# Altium schematic sheet 02 - Power CSI and Bank Power.SchDoc: Power CSI and Banks
size A3; Page Number: 2; Page Size: B; Page Count: 12; Board Rev: B; Project Name: CrossLink-NX Evaluation Board; RevCode: 1.0; Doc: 305-PD-19-0819; DsnPath: C:\Users\HAltinkilit\Downloads\Crosslink-NX-Design-Files\CrossLink-NX-Eval-Brd-Schematic-RevB-191122.DSN; SchematicName: SCHEMATIC1; PageName: 11 - Power CSI and Bank Power; PageSize: B; TopSchematic: True
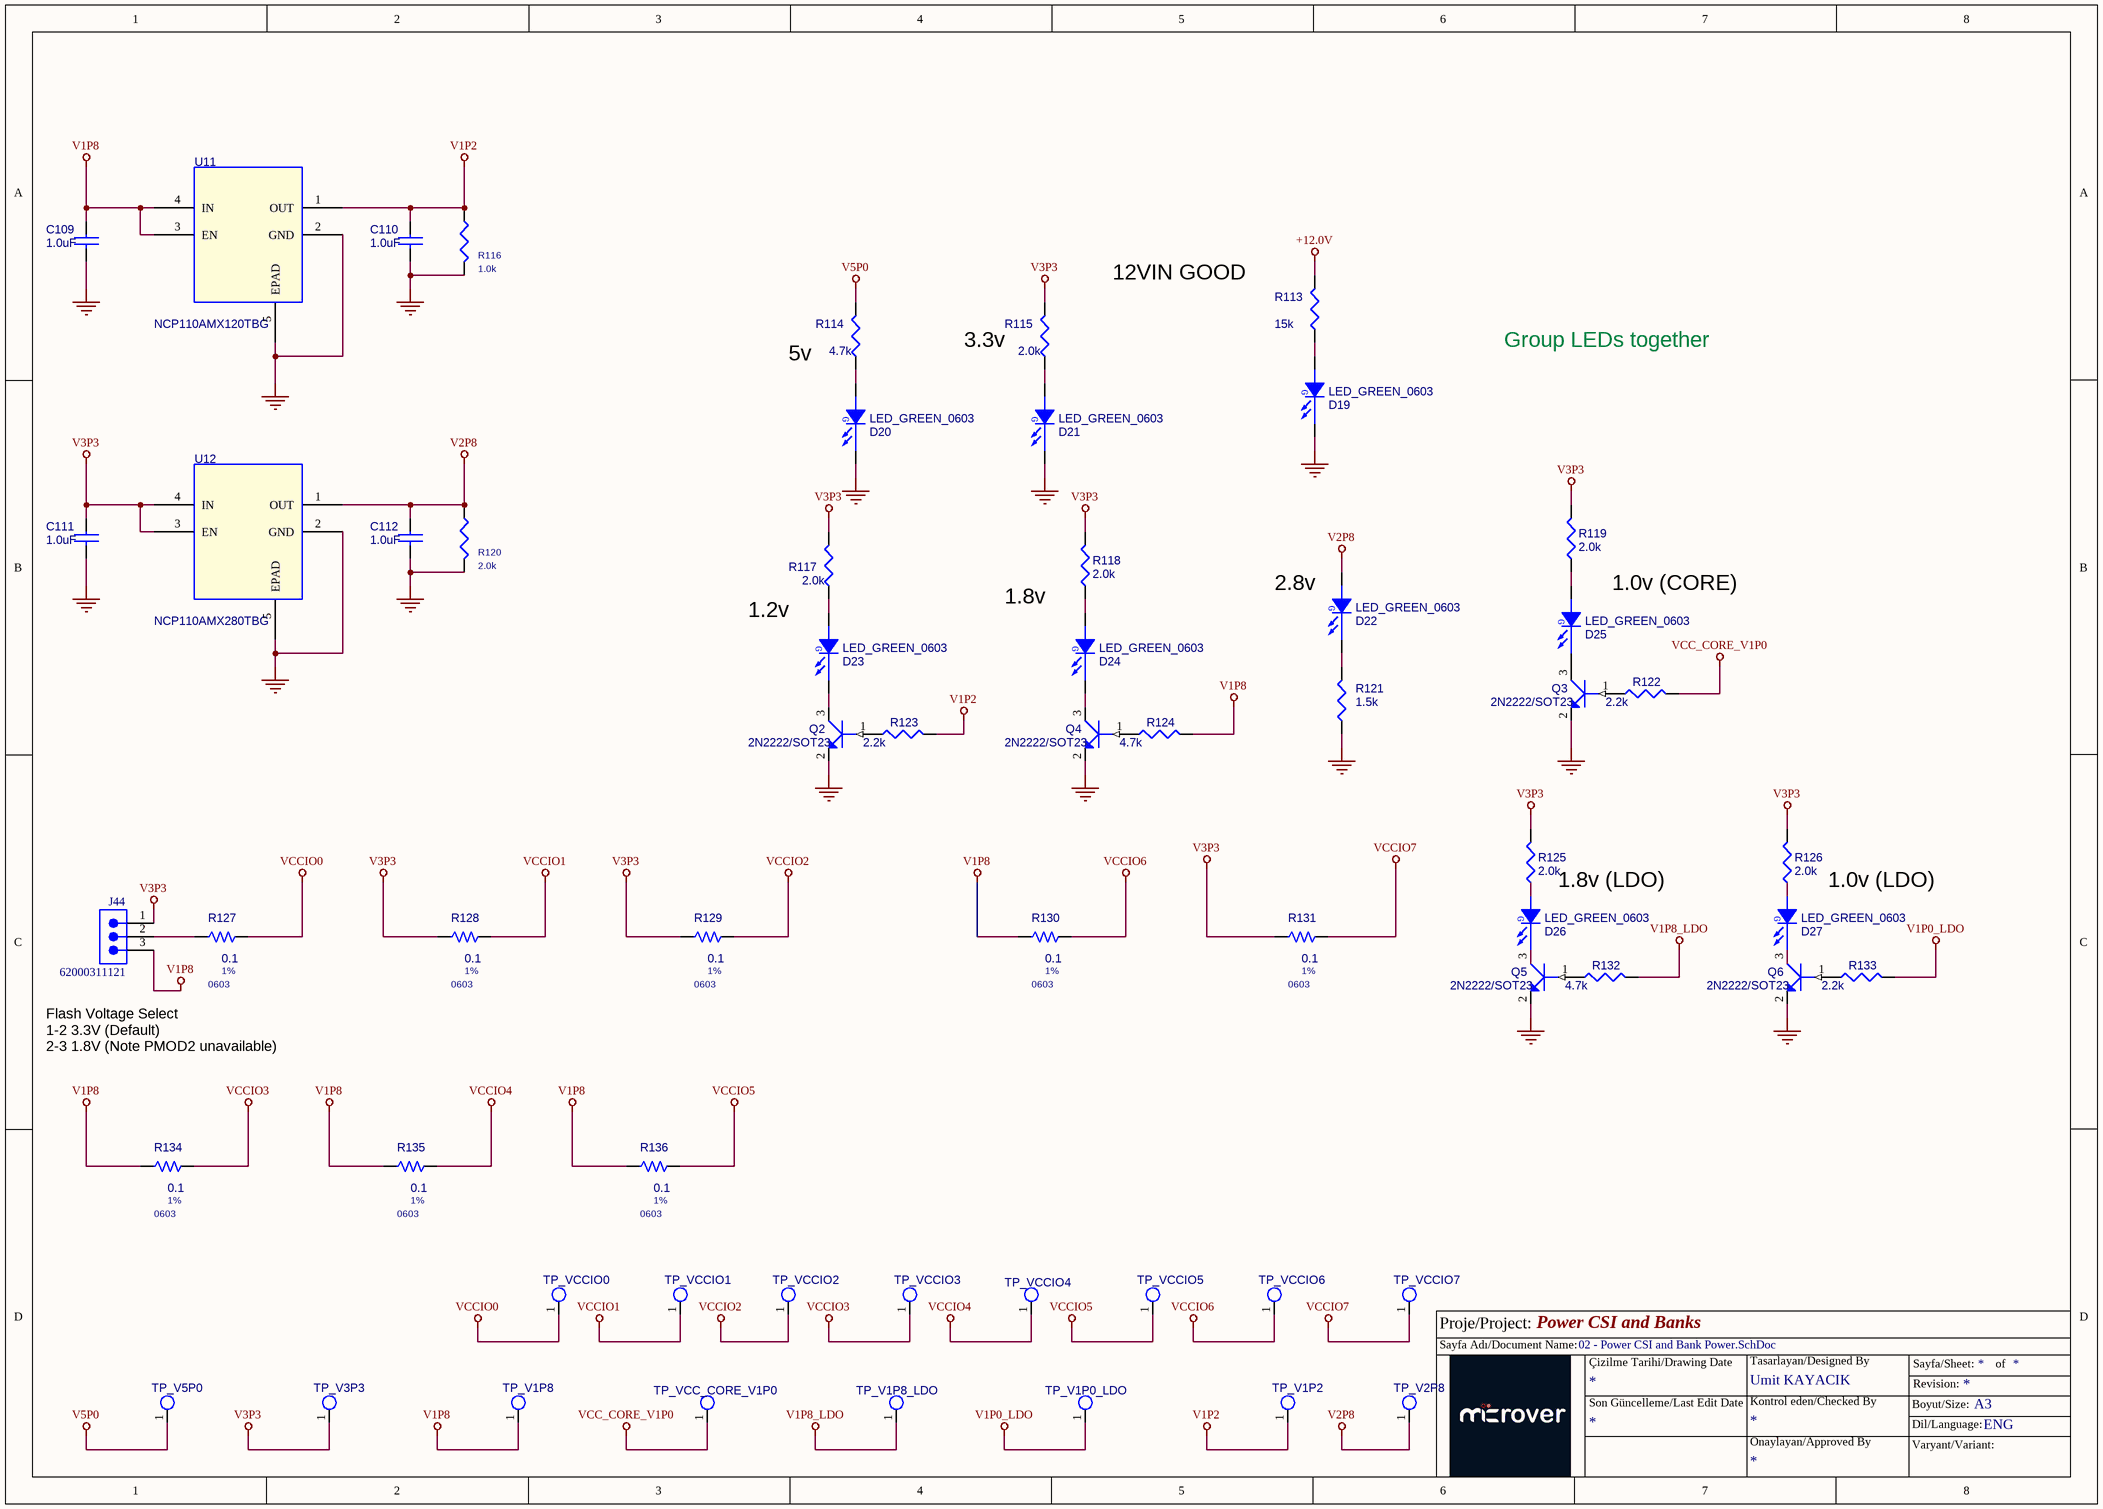
[diagram p0: 02 - Power CSI and Bank Power.SchDoc]

## Parts
C109  1.0uF  [C0603]
C110  1.0uF  [C0603]
C111  1.0uF  [C0603]
C112  1.0uF  [C0603]
D19  LED_GREEN_0603  [APT1608]
D20  LED_GREEN_0603  [APT1608]
D21  LED_GREEN_0603  [APT1608]
D22  LED_GREEN_0603  [APT1608]
D23  LED_GREEN_0603  [APT1608]
D24  LED_GREEN_0603  [APT1608]
D25  LED_GREEN_0603  [APT1608]
D26  LED_GREEN_0603  [APT1608]
D27  LED_GREEN_0603  [APT1608]
J44  62000311121  [62000311121]
Q2  2N2222/SOT23  [MMBT2222ALT-1]
Q3  2N2222/SOT23  [MMBT2222ALT-1]
Q4  2N2222/SOT23  [MMBT2222ALT-1]
Q5  2N2222/SOT23  [MMBT2222ALT-1]
Q6  2N2222/SOT23  [MMBT2222ALT-1]
R113  15k  [RLP-103]
R114  4.7k  [R0402]
R115  2.0k  [R0402]
R116  1.0k  [R0402]
R117  2.0k  [R0402]
R118  2.0k  [R0402]
R119  2.0k  [R0402]
R120  2.0k  [R0402]
R121  1.5k  [R0402]
R122  2.2k  [R0402]
R123  2.2k  [R0402]
R124  4.7k  [R0402]
R125  2.0k  [R0402]
R126  2.0k  [R0402]
R127  0.1  Tollerance: 1%  [0603]
R128  0.1  Tollerance: 1%  [0603]
R129  0.1  Tollerance: 1%  [0603]
R130  0.1  Tollerance: 1%  [0603]
R131  0.1  Tollerance: 1%  [0603]
R132  4.7k  [R0402]
R133  2.2k  [R0402]
R134  0.1  Tollerance: 1%  [0603]
R135  0.1  Tollerance: 1%  [0603]
R136  0.1  Tollerance: 1%  [0603]
TP_V1P0_LDO  TP_S_40_63  [TP_1MM]  (value not drawn)
TP_V1P2  TP_S_40_63  [TP_1MM]  (value not drawn)
TP_V1P8  TP_S_40_63  [TP_1MM]  (value not drawn)
TP_V1P8_LDO  TP_S_40_63  [TP_1MM]  (value not drawn)
TP_V2P8  TP_S_40_63  [TP_1MM]  (value not drawn)
TP_V3P3  TP_S_40_63  [TP_1MM]  (value not drawn)
TP_V5P0  TP_S_40_63  [TP_1MM]  (value not drawn)
TP_VCC_CORE_V1P0  TP_S_40_63  [TP_1MM]  (value not drawn)
TP_VCCIO0  TP_S_40_63  [TP_1MM]  (value not drawn)
TP_VCCIO1  TP_S_40_63  [TP_1MM]  (value not drawn)
TP_VCCIO2  TP_S_40_63  [TP_1MM]  (value not drawn)
TP_VCCIO3  TP_S_40_63  [TP_1MM]  (value not drawn)
TP_VCCIO4  TP_S_40_63  [TP_1MM]  (value not drawn)
TP_VCCIO5  TP_S_40_63  [TP_1MM]  (value not drawn)
TP_VCCIO6  TP_S_40_63  [TP_1MM]  (value not drawn)
TP_VCCIO7  TP_S_40_63  [TP_1MM]  (value not drawn)
U11  NCP110AMX120TBG  [4XDFN_NCP110]
U12  NCP110AMX280TBG  [4XDFN_NCP110]

## Nets
+12.0V: R113.2
GND: C109.2 C110.2 C111.2 C112.2 D19.1(CATHODE) D20.1(CATHODE) D21.1(CATHODE) Q2.2(EMITTER) Q3.2(EMITTER) Q4.2(EMITTER) Q5.2(EMITTER) Q6.2(EMITTER) R116.2 R120.2 R121.1 U11.2(GND) U11.5(EPAD) U12.2(GND) U12.5(EPAD)
V1P0_LDO: R133.2 TP_V1P0_LDO.1(TP)
V1P2: C110.1 R116.1 R123.2 TP_V1P2.1(TP) U11.1(OUT)
V1P8: C109.1 J44.3 R124.2 R130.1 R134.1 R135.1 R136.1 TP_V1P8.1(TP) U11.3(EN) U11.4(IN)
V1P8_LDO: R132.2 TP_V1P8_LDO.1(TP)
V2P8: C112.1 D22.2(ANODE) R120.1 TP_V2P8.1(TP) U12.1(OUT)
V3P3: C111.1 J44.1 R115.2 R117.2 R118.2 R119.2 R125.2 R126.2 R128.1 R129.1 R131.1 TP_V3P3.1(TP) U12.3(EN) U12.4(IN)
V5P0: R114.2 TP_V5P0.1(TP)
VCC_CORE_V1P0: R122.2 TP_VCC_CORE_V1P0.1(TP)
VCCIO0: R127.2 TP_VCCIO0.1(TP)
VCCIO1: R128.2 TP_VCCIO1.1(TP)
VCCIO2: R129.2 TP_VCCIO2.1(TP)
VCCIO3: R134.2 TP_VCCIO3.1(TP)
VCCIO4: R135.2 TP_VCCIO4.1(TP)
VCCIO5: R136.2 TP_VCCIO5.1(TP)
VCCIO6: R130.2 TP_VCCIO6.1(TP)
VCCIO7: R131.2 TP_VCCIO7.1(TP)
NetD19_2: D19.2(ANODE) R113.1
NetD20_2: D20.2(ANODE) R114.1
NetD21_2: D21.2(ANODE) R115.1
NetD22_1: D22.1(CATHODE) R121.2
NetD23_1: D23.1(CATHODE) Q2.3(COLLECTOR)
NetD23_2: D23.2(ANODE) R117.1
NetD24_1: D24.1(CATHODE) Q4.3(COLLECTOR)
NetD24_2: D24.2(ANODE) R118.1
NetD25_1: D25.1(CATHODE) Q3.3(COLLECTOR)
NetD25_2: D25.2(ANODE) R119.1
NetD26_1: D26.1(CATHODE) Q5.3(COLLECTOR)
NetD26_2: D26.2(ANODE) R125.1
NetD27_1: D27.1(CATHODE) Q6.3(COLLECTOR)
NetD27_2: D27.2(ANODE) R126.1
NetJ44_2: J44.2 R127.1
NetQ2_1: Q2.1(BASE) R123.1
NetQ3_1: Q3.1(BASE) R122.1
NetQ4_1: Q4.1(BASE) R124.1
NetQ5_1: Q5.1(BASE) R132.1
NetQ6_1: Q6.1(BASE) R133.1

## Notes on the sheet
- 12VIN GOOD
- 5v
- 3.3v
- Group LEDs together
- 1.2v
- 1.8v
- (near D22) 2.8v
- 1.0v (CORE)
- 1.8v (LDO)
- 1.0v (LDO)
- Flash Voltage Select
  1-2 3.3V (Default)
  2-3 1.8V (Note PMOD2 unavailable)
- Proje/Project:
- Sayfa Adı/Document Name:
- Çizilme Tarihi/Drawing Date
- Umit KAYACIK
- Tasarlayan/Designed By
- Sayfa/Sheet:
- Revision:
- of
- Son Güncelleme/Last Edit Date
- Kontrol eden/Checked By
- Onaylayan/Approved By
- Boyut/Size:
- Varyant/Variant:
- Dil/Language:
- A3
- ENG
- (in symbol LED-SMT1206_GREEN_1) G

## Library data of the parts
C109 = CAP NP: CAP CER 10UF 10V 20% X6S 0603; Part Reference: C109; Manufacturer Part Number: CL10X106MP8NRNC; Manufacturer: Samsung; Value: 1.0uF; Assy: -; MFG P/N: CL10X106MP8NRNC; Man. Part #: CL10X106MP8NRNC; MFG: Samsung; PCB Footprint: C0603
C110 = CAP NP: CAP CER 10UF 10V 20% X6S 0603; Part Reference: C110; Manufacturer Part Number: CL10X106MP8NRNC; Manufacturer: Samsung; Value: 1.0uF; Assy: -; MFG P/N: CL10X106MP8NRNC; Man. Part #: CL10X106MP8NRNC; MFG: Samsung; PCB Footprint: C0603
C111 = CAP NP: CAP CER 10UF 10V 20% X6S 0603; Part Reference: C111; Man. Part #: CL10X106MP8NRNC; MFG: Samsung; Value: 1.0uF; Assy: -; Manufacturer: Samsung; MFG P/N: CL10X106MP8NRNC; Manufacturer Part Number: CL10X106MP8NRNC; PCB Footprint: C0603
C112 = CAP NP: CAP CER 10UF 10V 20% X6S 0603; Part Reference: C112; Man. Part #: CL10X106MP8NRNC; MFG: Samsung; Value: 1.0uF; Assy: -; Manufacturer: Samsung; MFG P/N: CL10X106MP8NRNC; Manufacturer Part Number: CL10X106MP8NRNC; PCB Footprint: C0603
D19 = LED-SMT1206_GREEN_1: Part Reference: D19; Value: LED_GREEN_0603; Assy: -; PCB Footprint: APT1608
D20 = LED-SMT1206_GREEN_1: Part Reference: D20; Value: LED_GREEN_0603; Assy: -; PCB Footprint: APT1608
D21 = LED-SMT1206_GREEN_1: Part Reference: D21; Value: LED_GREEN_0603; Assy: -; PCB Footprint: APT1608
D22 = LED-SMT1206_GREEN_1: Part Reference: D22; Value: LED_GREEN_0603; Assy: -; PCB Footprint: APT1608
D23 = LED-SMT1206_GREEN_1: Part Reference: D23; Value: LED_GREEN_0603; Assy: -; PCB Footprint: APT1608
D24 = LED-SMT1206_GREEN_1: Part Reference: D24; Value: LED_GREEN_0603; Assy: -; PCB Footprint: APT1608
D25 = LED-SMT1206_GREEN_1: Part Reference: D25; Value: LED_GREEN_0603; Assy: -; PCB Footprint: APT1608
D26 = LED-SMT1206_GREEN_1: Part Reference: D26; Value: LED_GREEN_0603; Assy: -; PCB Footprint: APT1608
D27 = LED-SMT1206_GREEN_1: Part Reference: D27; Value: LED_GREEN_0603; Assy: -; PCB Footprint: APT1608
J44 = CMP-1502-00957-5: THT Vertical Pin Header WR-PHD, Pitch 2.00 mm, Single Row, 3 pins; Voltage Rating: 200V; Current Rating: 2A; Gender: Male; Contact Resistance: 20mΩ; Number of Contacts: 3; Min Operating Temperature: -40°C; Max Operating Temperature: 105°C; Height: 6.35mm; Operating Supply Voltage: 200V; Number of Rows: 1; RoHS: Compliant; Number of Pins: 3; Contact Material: Gold; Lead Pitch: 2mm; Orientation: Vertical
Q2 = 2N2222: Part Reference: Q2; Value: 2N2222/SOT23; Assy: -; PCB Footprint: MMBT2222ALT-1
Q3 = 2N2222: Part Reference: Q3; Value: 2N2222/SOT23; Assy: -; PCB Footprint: MMBT2222ALT-1
Q4 = 2N2222: Part Reference: Q4; Value: 2N2222/SOT23; Assy: -; PCB Footprint: MMBT2222ALT-1
Q5 = 2N2222: Part Reference: Q5; Value: 2N2222/SOT23; Assy: -; PCB Footprint: MMBT2222ALT-1
Q6 = 2N2222: Part Reference: Q6; Value: 2N2222/SOT23; Assy: -; PCB Footprint: MMBT2222ALT-1
R113 = RES_0: Part Reference: R113; Value: 15k; Assy: -; PCB Footprint: RLP-103
R114 = RES_0: RES SMD 2.2K OHM 1% 1/10W 0402; Part Reference: R114; Manufacturer Part Number: ERJ-2RKF2201X; Manufacturer: Panasonic; Value: 4.7k; Assy: -; PCB Footprint: R0402
R115 = RES_0: RES SMD 1K OHM 1% 1/10W 0402; Part Reference: R115; Manufacturer: Panasonic; Manufacturer Part Number: ERJ-2RKF1001X; Value: 2.0k; Assy: -; PCB Footprint: R0402
R116 = RES_1K_1W16_0402_5P: RES SMD 1K OHM 1% 1/10W 0402; Part Reference: R116; Manufacturer: Panasonic; Manufacturer Part Number: ERJ-2RKF1001X; Unit Price (USD): 0.02; Total Area(sq-mm): 0.5; Wattage: 1/16W; DIST: FLAT; MAX_TEMP: RTMAX; MFG P/N: RMCF0402JT1K00; MFG: Stackpole Electronics Inc; TC1: 0; Length(mm): 1; Width(mm): 0.5; TC2: 0; Value: 1.0k; Assy: -; PCB Footprint: R0402; Reference: R116
R117 = RES_0: RES SMD 1K OHM 1% 1/10W 0402; Part Reference: R117; Manufacturer Part Number: ERJ-2RKF1001X; Manufacturer: Panasonic; Value: 2.0k; Assy: -; PCB Footprint: R0402
R118 = RES_0: RES SMD 1K OHM 1% 1/10W 0402; Part Reference: R118; Manufacturer Part Number: ERJ-2RKF1001X; Manufacturer: Panasonic; Value: 2.0k; Assy: -; PCB Footprint: R0402
R119 = RES_0: RES SMD 1K OHM 1% 1/10W 0402; Part Reference: R119; Manufacturer Part Number: ERJ-2RKF1001X; Manufacturer: Panasonic; Value: 2.0k; Assy: -; PCB Footprint: R0402
R120 = RES_1K_1W16_0402_5P: RES SMD 1K OHM 1% 1/10W 0402; Part Reference: R120; Manufacturer Part Number: ERJ-2RKF1001X; Manufacturer: Panasonic; Unit Price (USD): 0.02; Total Area(sq-mm): 0.5; Wattage: 1/16W; DIST: FLAT; MAX_TEMP: RTMAX; MFG P/N: RMCF0402JT1K00; MFG: Stackpole Electronics Inc; TC1: 0; Length(mm): 1; Width(mm): 0.5; TC2: 0; Value: 2.0k; Assy: -; PCB Footprint: R0402; Reference: R120
R121 = RES_0: RES SMD 750 OHM 5% 1/10W 0402; Part Reference: R121; Manufacturer: Panasonic; Manufacturer Part Number: ERJ-2GEJ751X; Value: 1.5k; Assy: -; PCB Footprint: R0402
R122 = RES_0: RES SMD 4.7K OHM 5% 1/10W 0402; Part Reference: R122; Manufacturer: Panasonic; MFG P/N: ERJ-2GEJ472X; Value: 2.2k; Assy: -; MFG: Panasonic; Manufacturer Part Number: ERJ-2GEJ472X; PCB Footprint: R0402
R123 = RES_0: RES SMD 4.7K OHM 5% 1/10W 0402; Part Reference: R123; Manufacturer: Panasonic; MFG P/N: ERJ-2GEJ472X; Value: 2.2k; MFG: Panasonic; Manufacturer Part Number: ERJ-2GEJ472X; Assy: -; PCB Footprint: R0402
R124 = RES_0: RES SMD 4.7K OHM 5% 1/10W 0402; Part Reference: R124; Manufacturer: Panasonic; MFG P/N: ERJ-2GEJ472X; Value: 4.7k; MFG: Panasonic; Manufacturer Part Number: ERJ-2GEJ472X; Assy: -; PCB Footprint: R0402
R125 = RES_0: RES SMD 1K OHM 1% 1/10W 0402; Part Reference: R125; Manufacturer: Panasonic; Manufacturer Part Number: ERJ-2RKF1001X; Value: 2.0k; Assy: -; PCB Footprint: R0402
R126 = RES_0: RES SMD 1K OHM 1% 1/10W 0402; Part Reference: R126; Manufacturer Part Number: ERJ-2RKF1001X; Manufacturer: Panasonic; Value: 2.0k; Assy: -; PCB Footprint: R0402
R127 = R_Dup2: Part Reference: R127; DIST: FLAT; PSpiceTemplate: R^@REFDES %1 %2 ?TOLERANCE|R^@REFDES| @VALUE  ?TOLERANCE|\n.model R^@REFDES RES R=1 DEV=@TOLERANCE%|; VOLTAGE: RVMAX; SLOPE: RSMAX; MAX_TEMP: RTMAX; POWER: RMAX; COMPHEIGHT: 0.000; MEMORY: NO; COMPGROUP: 0; COMPROT: 180; COMPLOC: [970.000,1160.000]; COMPSIDE: TOP; FPLIST: AX/RC05,SM/R_0603; Value: 0.1; Assy: -; DECOUPLER: NO; COMPKEY: NO; COMPLOCKED: NO; COMPFIXED: NO; PCB Footprint: 0603
R128 = R_Dup2: Part Reference: R128; DIST: FLAT; PSpiceTemplate: R^@REFDES %1 %2 ?TOLERANCE|R^@REFDES| @VALUE  ?TOLERANCE|\n.model R^@REFDES RES R=1 DEV=@TOLERANCE%|; VOLTAGE: RVMAX; SLOPE: RSMAX; MAX_TEMP: RTMAX; POWER: RMAX; COMPHEIGHT: 0.000; MEMORY: NO; COMPGROUP: 0; COMPROT: 180; COMPLOC: [970.000,1160.000]; COMPSIDE: TOP; FPLIST: AX/RC05,SM/R_0603; Value: 0.1; Assy: -; DECOUPLER: NO; COMPKEY: NO; COMPLOCKED: NO; COMPFIXED: NO; PCB Footprint: 0603
R129 = R_Dup2: Part Reference: R129; DIST: FLAT; PSpiceTemplate: R^@REFDES %1 %2 ?TOLERANCE|R^@REFDES| @VALUE  ?TOLERANCE|\n.model R^@REFDES RES R=1 DEV=@TOLERANCE%|; VOLTAGE: RVMAX; SLOPE: RSMAX; MAX_TEMP: RTMAX; POWER: RMAX; COMPHEIGHT: 0.000; MEMORY: NO; COMPGROUP: 0; COMPROT: 180; COMPLOC: [970.000,1160.000]; COMPSIDE: TOP; FPLIST: AX/RC05,SM/R_0603; Value: 0.1; Assy: -; DECOUPLER: NO; COMPKEY: NO; COMPLOCKED: NO; COMPFIXED: NO; PCB Footprint: 0603
R130 = R_Dup2: Part Reference: R130; DIST: FLAT; PSpiceTemplate: R^@REFDES %1 %2 ?TOLERANCE|R^@REFDES| @VALUE  ?TOLERANCE|\n.model R^@REFDES RES R=1 DEV=@TOLERANCE%|; VOLTAGE: RVMAX; SLOPE: RSMAX; MAX_TEMP: RTMAX; POWER: RMAX; FPLIST: AX/RC05,SM/R_0603; COMPSIDE: TOP; COMPLOC: [970.000,1160.000]; COMPROT: 180; COMPGROUP: 0; COMPFIXED: NO; COMPHEIGHT: 0.000; Value: 0.1; Assy: -; COMPLOCKED: NO; COMPKEY: NO; DECOUPLER: NO; MEMORY: NO; PCB Footprint: 0603
R131 = R_Dup2: Part Reference: R131; DIST: FLAT; PSpiceTemplate: R^@REFDES %1 %2 ?TOLERANCE|R^@REFDES| @VALUE  ?TOLERANCE|\n.model R^@REFDES RES R=1 DEV=@TOLERANCE%|; VOLTAGE: RVMAX; SLOPE: RSMAX; MAX_TEMP: RTMAX; POWER: RMAX; FPLIST: AX/RC05,SM/R_0603; COMPSIDE: TOP; COMPLOC: [970.000,1160.000]; COMPROT: 180; COMPGROUP: 0; COMPFIXED: NO; COMPHEIGHT: 0.000; Value: 0.1; Assy: -; COMPLOCKED: NO; COMPKEY: NO; DECOUPLER: NO; MEMORY: NO; PCB Footprint: 0603
R132 = RES_0: RES SMD 4.7K OHM 5% 1/10W 0402; Part Reference: R132; Manufacturer Part Number: ERJ-2GEJ472X; MFG: Panasonic; Value: 4.7k; Assy: -; Manufacturer: Panasonic; MFG P/N: ERJ-2GEJ472X; PCB Footprint: R0402
R133 = RES_0: RES SMD 4.7K OHM 5% 1/10W 0402; Part Reference: R133; Manufacturer Part Number: ERJ-2GEJ472X; MFG: Panasonic; Value: 2.2k; Assy: -; Manufacturer: Panasonic; MFG P/N: ERJ-2GEJ472X; PCB Footprint: R0402
R134 = R_Dup2: Part Reference: R134; DIST: FLAT; PSpiceTemplate: R^@REFDES %1 %2 ?TOLERANCE|R^@REFDES| @VALUE  ?TOLERANCE|\n.model R^@REFDES RES R=1 DEV=@TOLERANCE%|; VOLTAGE: RVMAX; SLOPE: RSMAX; MAX_TEMP: RTMAX; POWER: RMAX; COMPHEIGHT: 0.000; MEMORY: NO; COMPGROUP: 0; COMPROT: 180; COMPLOC: [970.000,1160.000]; COMPSIDE: TOP; FPLIST: AX/RC05,SM/R_0603; Value: 0.1; Assy: -; DECOUPLER: NO; COMPKEY: NO; COMPLOCKED: NO; COMPFIXED: NO; PCB Footprint: 0603
R135 = R_Dup2: Part Reference: R135; DIST: FLAT; PSpiceTemplate: R^@REFDES %1 %2 ?TOLERANCE|R^@REFDES| @VALUE  ?TOLERANCE|\n.model R^@REFDES RES R=1 DEV=@TOLERANCE%|; VOLTAGE: RVMAX; SLOPE: RSMAX; MAX_TEMP: RTMAX; POWER: RMAX; COMPHEIGHT: 0.000; MEMORY: NO; COMPGROUP: 0; COMPROT: 180; COMPLOC: [970.000,1160.000]; COMPSIDE: TOP; FPLIST: AX/RC05,SM/R_0603; Value: 0.1; Assy: -; DECOUPLER: NO; COMPKEY: NO; COMPLOCKED: NO; COMPFIXED: NO; PCB Footprint: 0603
R136 = R_Dup2: Part Reference: R136; DIST: FLAT; PSpiceTemplate: R^@REFDES %1 %2 ?TOLERANCE|R^@REFDES| @VALUE  ?TOLERANCE|\n.model R^@REFDES RES R=1 DEV=@TOLERANCE%|; VOLTAGE: RVMAX; SLOPE: RSMAX; MAX_TEMP: RTMAX; POWER: RMAX; COMPHEIGHT: 0.000; MEMORY: NO; COMPGROUP: 0; COMPROT: 180; COMPLOC: [970.000,1160.000]; COMPSIDE: TOP; FPLIST: AX/RC05,SM/R_0603; Value: 0.1; Assy: -; DECOUPLER: NO; COMPKEY: NO; COMPLOCKED: NO; COMPFIXED: NO; PCB Footprint: 0603
TP_V1P0_LDO = TP_S_40_63: Square test point, 40mil inner diameter, 63mil outer diameter; Part Reference: TP_V1P0_LDO; Assy: DNI; Class: IO; Value: TP_S_40_63; PCB Footprint: tp_s_40_63
TP_V1P2 = TP_S_40_63: Square test point, 40mil inner diameter, 63mil outer diameter; Part Reference: TP_V1P2; Assy: DNI; Class: IO; Value: TP_S_40_63; PCB Footprint: tp_s_40_63
TP_V1P8 = TP_S_40_63: Square test point, 40mil inner diameter, 63mil outer diameter; Part Reference: TP_V1P8; Assy: DNI; Class: IO; Value: TP_S_40_63; PCB Footprint: tp_s_40_63
TP_V1P8_LDO = TP_S_40_63: Square test point, 40mil inner diameter, 63mil outer diameter; Part Reference: TP_V1P8_LDO; Assy: DNI; Class: IO; Value: TP_S_40_63; PCB Footprint: tp_s_40_63
TP_V2P8 = TP_S_40_63: Square test point, 40mil inner diameter, 63mil outer diameter; Part Reference: TP_V2P8; Assy: DNI; Class: IO; Value: TP_S_40_63; PCB Footprint: tp_s_40_63
TP_V3P3 = TP_S_40_63: Square test point, 40mil inner diameter, 63mil outer diameter; Part Reference: TP_V3P3; Assy: DNI; Class: IO; Value: TP_S_40_63; PCB Footprint: tp_s_40_63
TP_V5P0 = TP_S_40_63: Square test point, 40mil inner diameter, 63mil outer diameter; Part Reference: TP_V5P0; Assy: DNI; Class: IO; Value: TP_S_40_63; PCB Footprint: tp_s_40_63
TP_VCC_CORE_V1P0 = TP_S_40_63: Square test point, 40mil inner diameter, 63mil outer diameter; Part Reference: TP_VCC_CORE_V1P0; Assy: DNI; Class: IO; Value: TP_S_40_63; PCB Footprint: tp_s_40_63
TP_VCCIO0 = TP_S_40_63: Square test point, 40mil inner diameter, 63mil outer diameter; Part Reference: TP_VCCIO0; Assy: DNI; Class: IO; Value: TP_S_40_63; PCB Footprint: tp_s_40_63
TP_VCCIO1 = TP_S_40_63: Square test point, 40mil inner diameter, 63mil outer diameter; Part Reference: TP_VCCIO1; Assy: DNI; Class: IO; Value: TP_S_40_63; PCB Footprint: tp_s_40_63
TP_VCCIO2 = TP_S_40_63: Square test point, 40mil inner diameter, 63mil outer diameter; Part Reference: TP_VCCIO2; Assy: DNI; Class: IO; Value: TP_S_40_63; PCB Footprint: tp_s_40_63
TP_VCCIO3 = TP_S_40_63: Square test point, 40mil inner diameter, 63mil outer diameter; Part Reference: TP_VCCIO3; Assy: DNI; Class: IO; Value: TP_S_40_63; PCB Footprint: tp_s_40_63
TP_VCCIO4 = TP_S_40_63: Square test point, 40mil inner diameter, 63mil outer diameter; Part Reference: TP_VCCIO4; Assy: DNI; Class: IO; Value: TP_S_40_63; PCB Footprint: tp_s_40_63
TP_VCCIO5 = TP_S_40_63: Square test point, 40mil inner diameter, 63mil outer diameter; Part Reference: TP_VCCIO5; Assy: DNI; Class: IO; Value: TP_S_40_63; PCB Footprint: tp_s_40_63
TP_VCCIO6 = TP_S_40_63: Square test point, 40mil inner diameter, 63mil outer diameter; Part Reference: TP_VCCIO6; Assy: DNI; Class: IO; Value: TP_S_40_63; PCB Footprint: tp_s_40_63
TP_VCCIO7 = TP_S_40_63: Square test point, 40mil inner diameter, 63mil outer diameter; Part Reference: TP_VCCIO7; Assy: DNI; Class: IO; Value: TP_S_40_63; PCB Footprint: tp_s_40_63
U11 = NCP110AMX120TBG: Part Reference: U11; Value: NCP110AMX120TBG; Assy: -; PCB Footprint: 4XDFN_NCP110
U12 = NCP110AMX280TBG: Part Reference: U12; Value: NCP110AMX280TBG; Assy: -; PCB Footprint: 4XDFN_NCP110